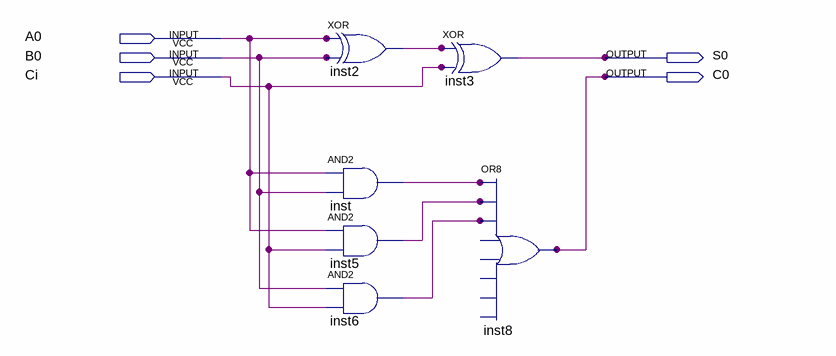
[diagram p0: schematic sheet]
// Quartus schematic 2-bit_CarryAdder.bdf as structural Verilog: 6 symbols, 5 pins
module \2-bit_CarryAdder  (
  input  A0,
  input  B0,
  input  Ci,
  output S0,
  output C0
);

  wire inst2_out, inst5_out, inst6_out, inst_out;

  xor inst2 (inst2_out, A0, B0);
  and inst (inst_out, A0, B0);
  and inst5 (inst5_out, A0, Ci);
  and inst6 (inst6_out, B0, Ci);
  xor inst3 (S0, inst2_out, Ci);
  or inst8 (C0, inst_out, inst5_out, inst6_out);  // open: IN4, IN5, IN6, IN7, IN8
endmodule
